# EAGLE design shifter (EAGLE 9.4.2)
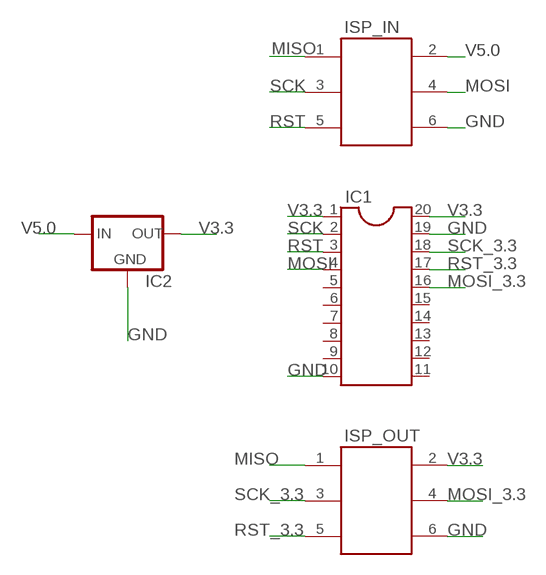
[diagram p0: schematic, sheet 1]

## Parts
IC1  DIL20  [DIL20]
IC2  MCP1700INLINE  [TO92-INLINE]
ISP_IN  61200621621  [61200621621]
ISP_OUT  61200621621  [61200621621]

## Nets
GND: IC1.10 IC1.19 IC2.1(GND) ISP_IN.6 ISP_OUT.6
MISO: ISP_IN.1 ISP_OUT.1
MOSI: IC1.4 ISP_IN.4
MOSI_3.3: IC1.16 ISP_OUT.4
RST: IC1.3 ISP_IN.5
RST_3.3: IC1.17 ISP_OUT.5
SCK: IC1.2 ISP_IN.3
SCK_3.3: IC1.18 ISP_OUT.3
V3.3: IC1.1 IC1.20 IC2.3(OUT) ISP_OUT.2
V5.0: IC2.2(IN) ISP_IN.2
Unconnected: IC1.5 IC1.6 IC1.7 IC1.8 IC1.9 IC1.11 IC1.12 IC1.13 IC1.14 IC1.15

## Library data of the parts
IC1 = ic-package:DIL20: Dual In Line / Socket
IC2 = adafruit:MCP1700: VOLTAGE REGULATOR
ISP_IN ISP_OUT = Wurth_Elektronik_Electromechanic_Wire_to_Board_Connectors_rev18a:61200621621: WR-BHD 2.54mm Male Box Header, 6 Pins=>Code : Con_WTB_BHD_2.54_Male_THT_WS_61200621621 <http://katalog.we-online.de/media/thumbs2/eican/thb_Con_WTB_BHD_2.54_Male_THT_WS_6120xx21621_pf2.jpg> Details see: http://katalog.we-online.de/en/em/612_0xx_216_21 Created 2014-06-04, Karrer Zheng 2014 (C) Würth Elektronik

## Board
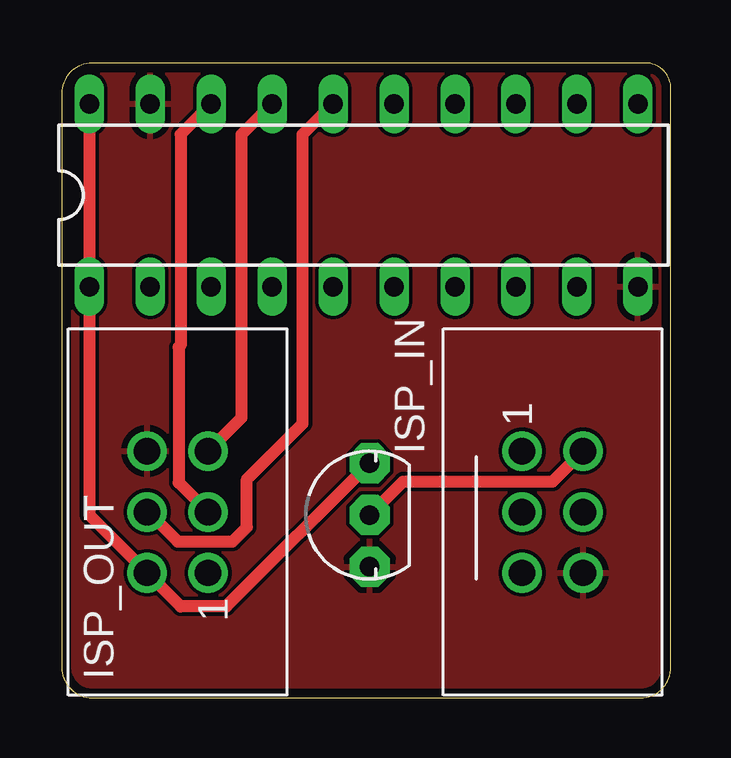
[diagram p1: board, top side]
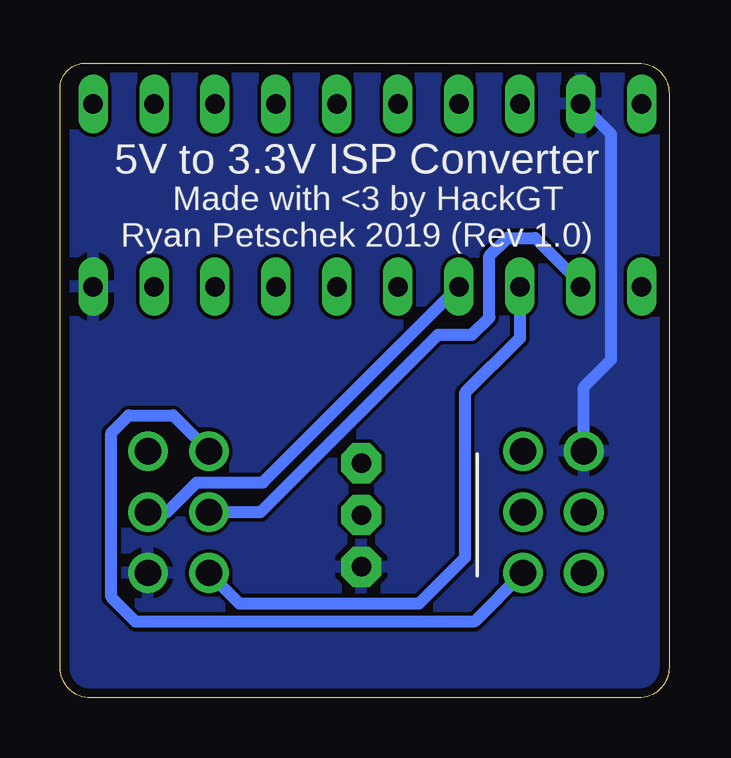
[diagram p2: board, bottom side, seen from below]

Size 25.38 x 26.47 mm. Coordinates in mm from the lower left corner, seen from the top.
Outline: 0,25.2 0,1.27 arc90 1.27,0 24.11,0 arc90 25.38,1.27 25.38,25.4 arc90 24.31,26.47 1.27,26.47 arc90 0,25.2
Copper layers (1*16): Top 0.035559375mm / dielectric 1.6mm / Bottom 0.035559375mm
Design rules "oshpark-2layer": minimum track width 6mil, minimum drill 10mil, track to track 6mil, track to pad 6mil, pad to pad 6mil, via to via 6mil, smd to smd 6mil, copper to edge 15mil, drill to drill 6mil, minimum pad ring 5mil, minimum via ring 5mil, stop-mask expansion 2.5mil, vias tented up to drill 0mil, thermal gap 10mil

### Footprints (pad centres in the part's own frame; a part is rotated, then mirrored left to right if it is on the bottom)
DIL20 = drill 0.813 long: 1 -11.43,-3.81; 2 -8.89,-3.81; 3 -6.35,-3.81; 4 -3.81,-3.81; 5 -1.27,-3.81; 6 1.27,-3.81; 7 3.81,-3.81; 8 6.35,-3.81; 9 8.89,-3.81; 10 11.43,-3.81; 11 11.43,3.81; 12 8.89,3.81; 13 6.35,3.81; 14 3.81,3.81; 15 1.27,3.81; 16 -1.27,3.81; 17 -3.81,3.81; 18 -6.35,3.81; 19 -8.89,3.81; 20 -11.43,3.81
TO92-INLINE = drill 0.813 pad 1.676 octagon: 1 -2.159,0; 2 0,0; 3 2.159,0
61200621621 = drill 1.1: 1 -2.54,-1.27; 2 -2.54,1.27; 3 0,-1.27; 4 0,1.27; 5 2.54,-1.27; 6 2.54,1.27

### Placement (x,y rotation side)
IC1  12.57,20.95 0 top
IC2  12.83,7.62 90 top
ISP_IN  20.45,7.75 270 top
ISP_OUT  4.83,7.75 90 top

### Tracks (layer width: path | path; a pad name or v marks a point on that pad's centre or on a via)
GND
  Bottom 0.508: ISP_OUT.6 3.56,12.95 2.41,14.1 2.41,23.5 IC1.19
  pour Top: 0,26.67 25.4,26.67 25.4,0 0,0
  pour Bottom: 0,26.67 25.4,26.67 25.4,0 0,0
MISO
  Bottom 0.508: ISP_OUT.1 8.13,3.17 22.23,3.17 23.24,4.19 23.24,11.05 22.52,11.77 20.66,11.77 ISP_IN.1
MOSI
  Bottom 0.508: ISP_IN.4 20.92,7.75 19.69,8.98 16.93,8.98 IC1.4
MOSI_3.3
  Top 0.508: ISP_OUT.4 3.59,7.75 4.82,6.52 7.11,6.52 7.71,7.11 7.71,9.11 10.03,11.43 10.03,23.5 IC1.16
RST
  Bottom 0.508: ISP_IN.5 17.91,3.94 10.41,3.94 8.51,5.84 8.51,12.7 6.22,14.99 IC1.3
RST_3.3
  Top 0.508: ISP_OUT.5 7.49,11.68 7.49,23.5 IC1.17
SCK
  Bottom 0.508: ISP_IN.3 17.02,7.75 9.63,15.14 8.21,15.14 7.49,15.86 7.49,18.43 6.75,19.18 5.59,19.18 3.68,17.27 IC1.2
SCK_3.3
  Top 0.508: IC1.18 4.95,23.5 4.95,14.7 4.87,14.61 4.87,8.98 ISP_OUT.3
V3.3
  Top 0.508: IC2.3 6.86,3.81 4.95,3.81 ISP_OUT.2 1.14,7.62 IC1.1 IC1.20
V5.0
  Top 0.508: IC2.2 14.22,9.02 20.45,9.02 ISP_IN.2

### Text on the board
bNames: 5V to 3.3V ISP Converter | Made with <3 by HackGT | Ryan Petschek 2019 (Rev 1.0)